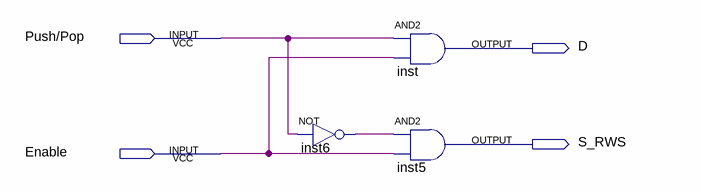
[diagram p0: schematic sheet]
// Quartus schematic CTLogic.bdf as structural Verilog: 3 symbols, 4 pins
module CTLogic (
  input  \Push/Pop ,
  input  Enable,
  output D,
  output S_RWS
);

  wire inst6_out;

  not inst6 (inst6_out, \Push/Pop );
  and inst (D, \Push/Pop , Enable);
  and inst5 (S_RWS, inst6_out, Enable);
endmodule
